# EAGLE design bootloader_burner (EAGLE 9.6.2)
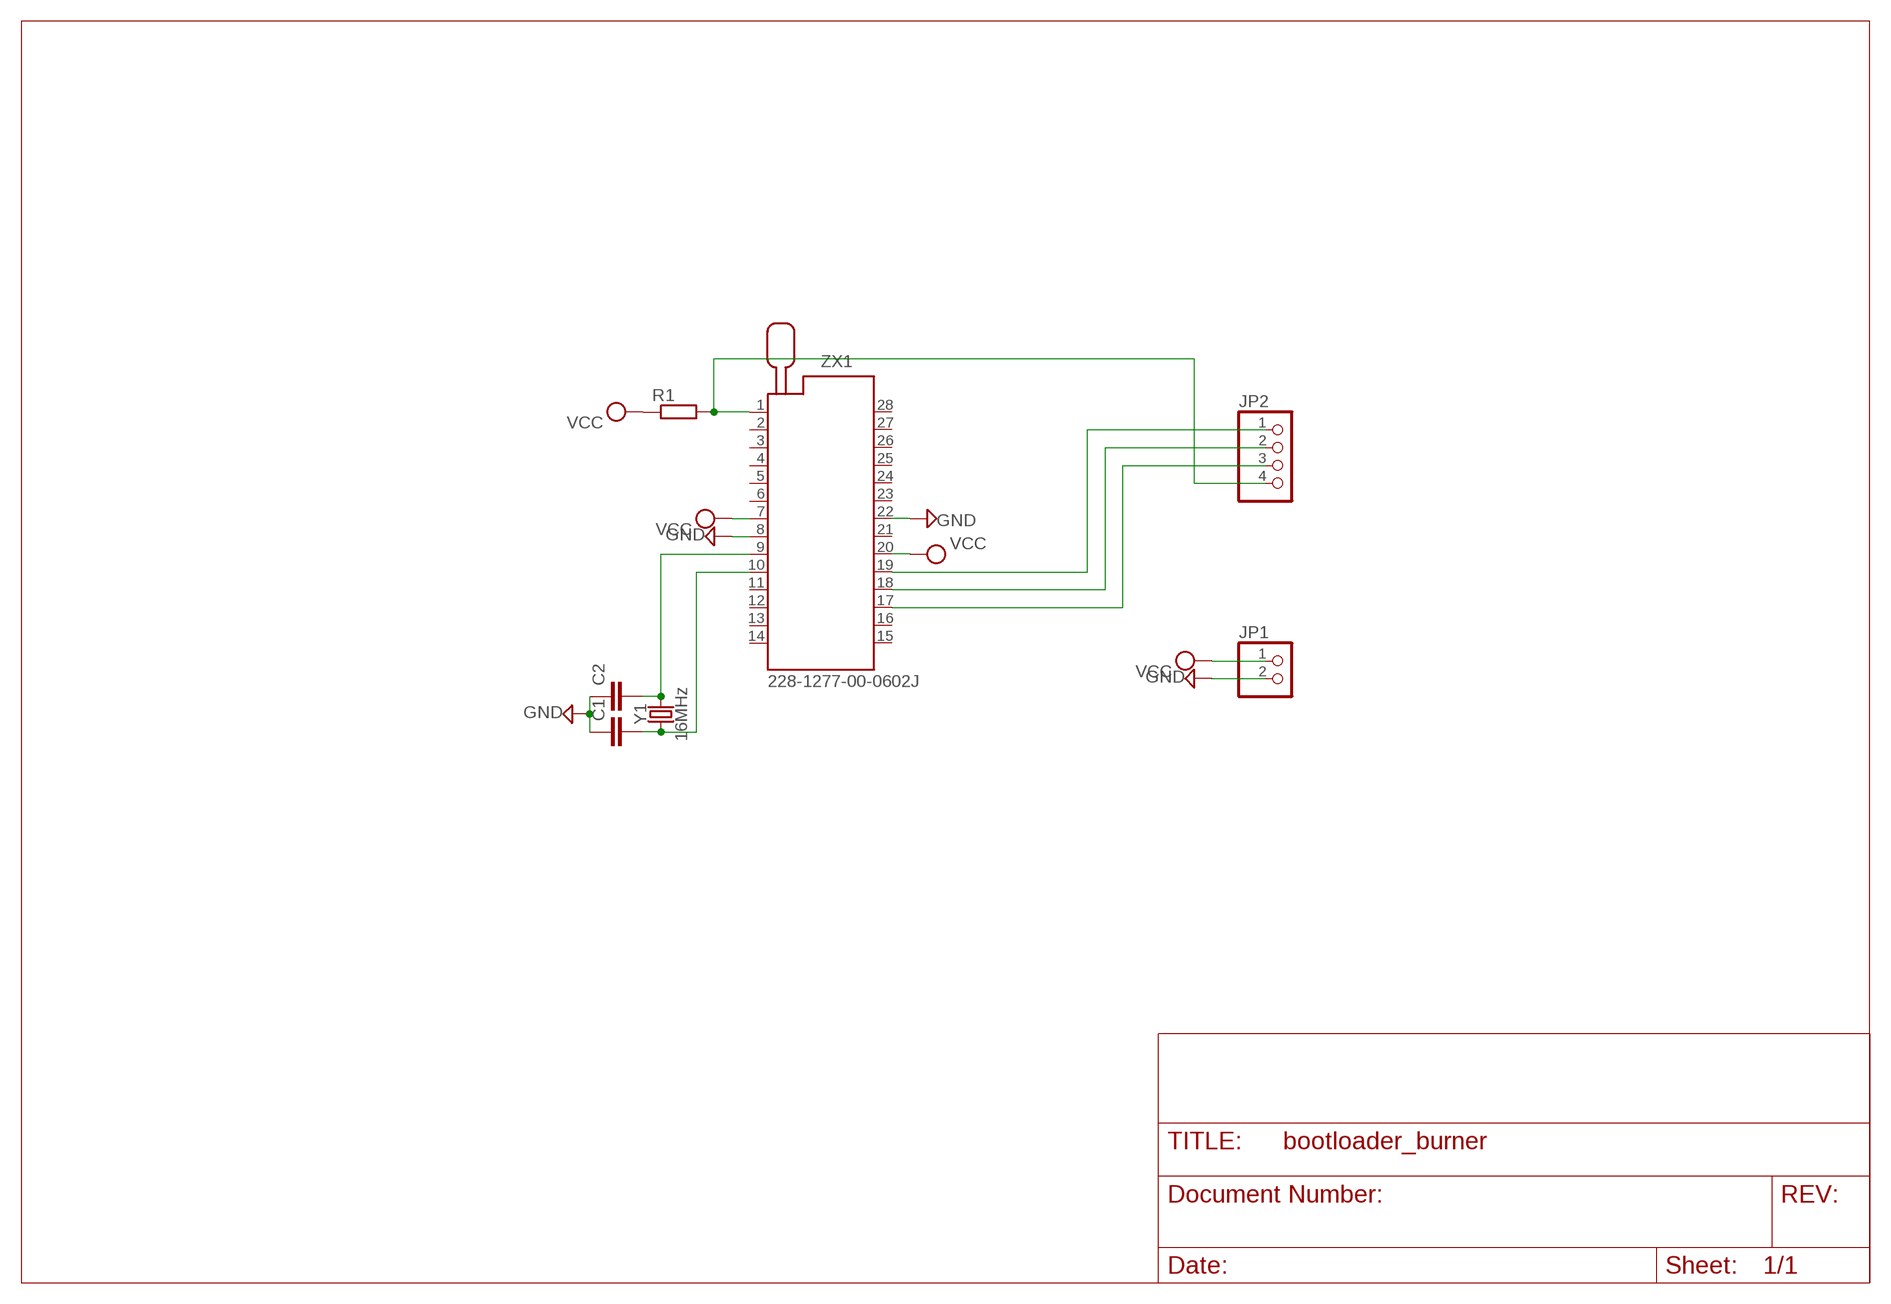
[diagram p0: schematic, sheet 1]

## Parts
C1  C-EU025-025X050  [C025-025X050]
C2  C-EU025-025X050  [C025-025X050]
JP1  PINHD-1X2  [1X02]
JP2  PINHD-1X4  [1X04]
R1  R-EU_0207/10  [0207/10]
Y1  16MHz  CRYSTAL-16MHZPTH-HC49US  [HC49US]
ZX1  228-1277-00-0602J  [228-1277-00-0602J]

## Nets
GND: C1.1 C2.1 JP1.2 ZX1.8 ZX1.22
N$4: C2.2 Y1.2 ZX1.9
N$5: C1.2 Y1.1 ZX1.10
PIN_10_ARDUINO: JP2.4 R1.2 ZX1.1
PIN_11_ARDUINO: JP2.3 ZX1.17
PIN_12_ARDUINO: JP2.2 ZX1.18
PIN_13_ARDUINO: JP2.1 ZX1.19
VCC: JP1.1 R1.1 ZX1.7 ZX1.20
Unconnected: ZX1.2 ZX1.3 ZX1.4 ZX1.5 ZX1.6 ZX1.11 ZX1.12 ZX1.13 ZX1.14 ZX1.15 ZX1.16 ZX1.21 ZX1.23 ZX1.24 ZX1.25 ZX1.26 ZX1.27 ZX1.28

## Library data of the parts
C1 C2 = rcl_capacitor:C-EU: CAPACITOR, European symbol; SPICEPREFIX: C
JP1 = pinhead:PINHD-1X2: PIN HEADER
JP2 = pinhead:PINHD-1X4: PIN HEADER
R1 = rcl:R-EU_: RESISTOR, European symbol; SPICEPREFIX: R
Y1 = SparkFun-Clocks:CRYSTAL-16MHZ: 16MHz Crystal Digikey Example <http://www.digikey.com/product-search/en?keywords=535-9122-1-ND> Frequency: 16MHz Frequency Stability: ±50ppm Frequency Tolerance: ±20ppm Load Capacitance: 18pF SparkFun Products: Pro Micro -5V/16MHz <https://www.sparkfun.com/products/12640> SparkFun Serial Enabled LCD Kit <https://www.sparkfun.com/products/10097>; PROD_ID: XTAL-08181; SF_ID: COM-00536
ZX1 = con-3m:228-?00-0602J: Zero Insertion Force Socked Source: http://www.3M.com/ehpd; MF: 3M; MPN: 228-1277-00-0602J; OC_FARNELL: 9897356; OC_NEWARK: 85K7825

## Net classes
0 default: clearance 0.205 mm

## Board
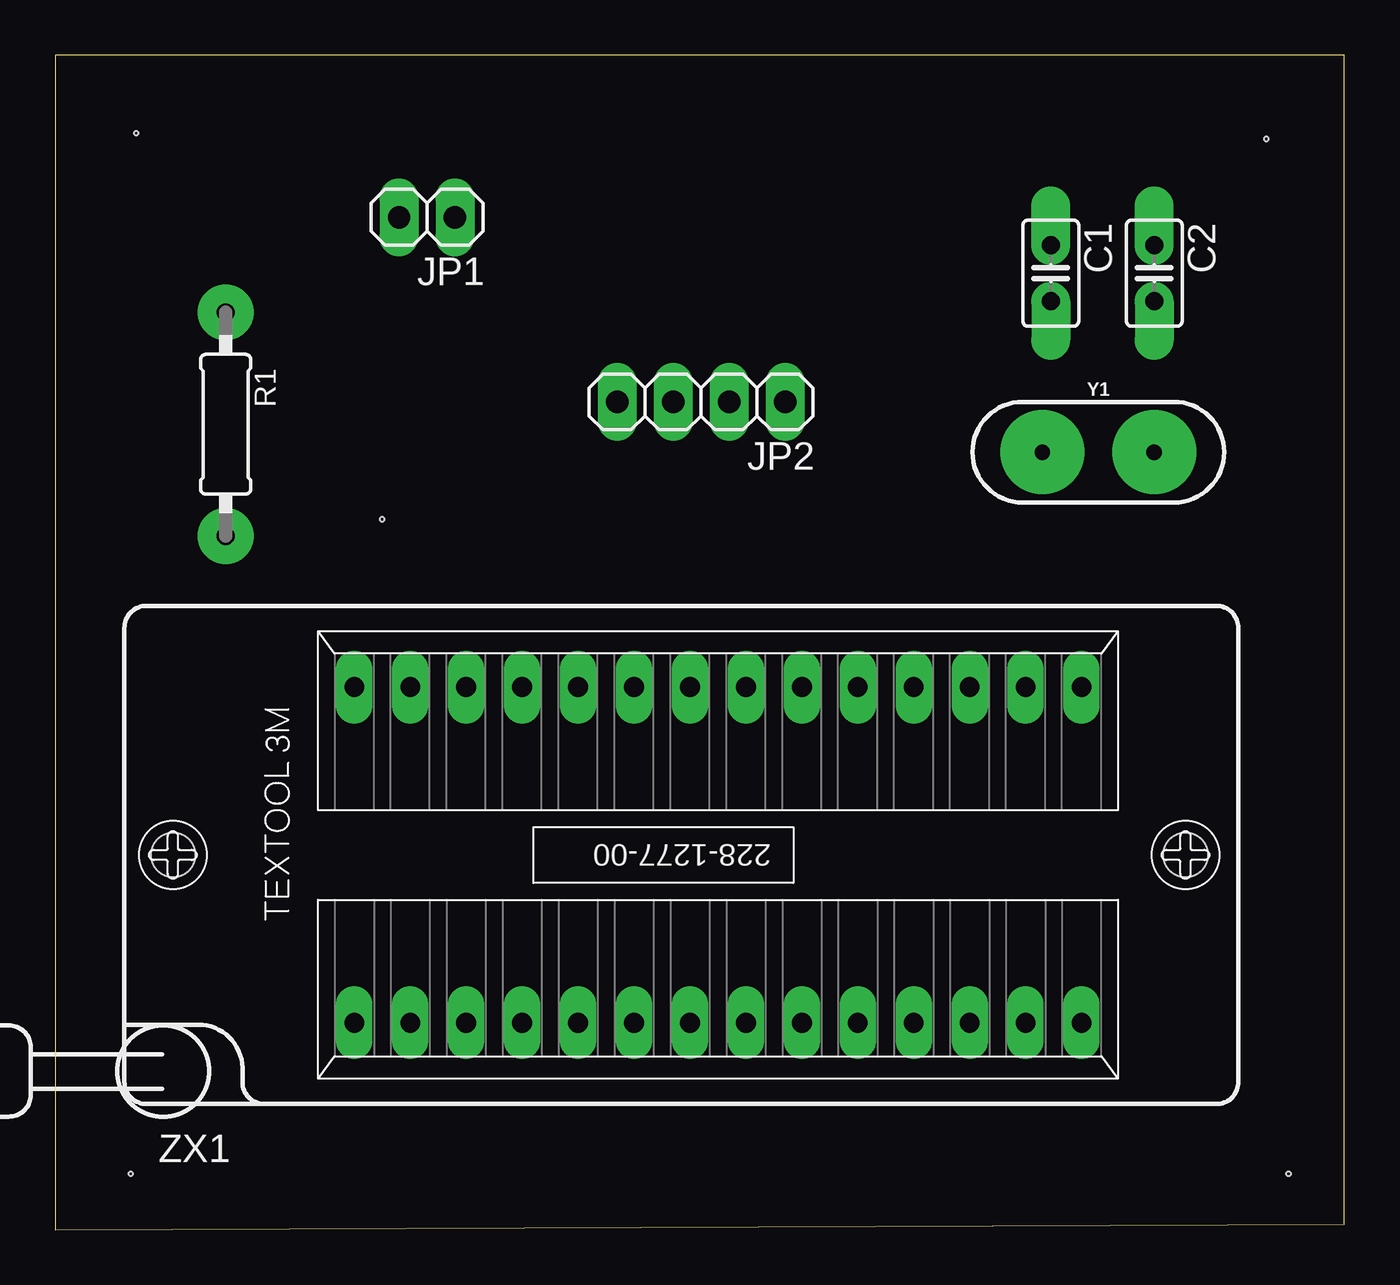
[diagram p1: board, top side]
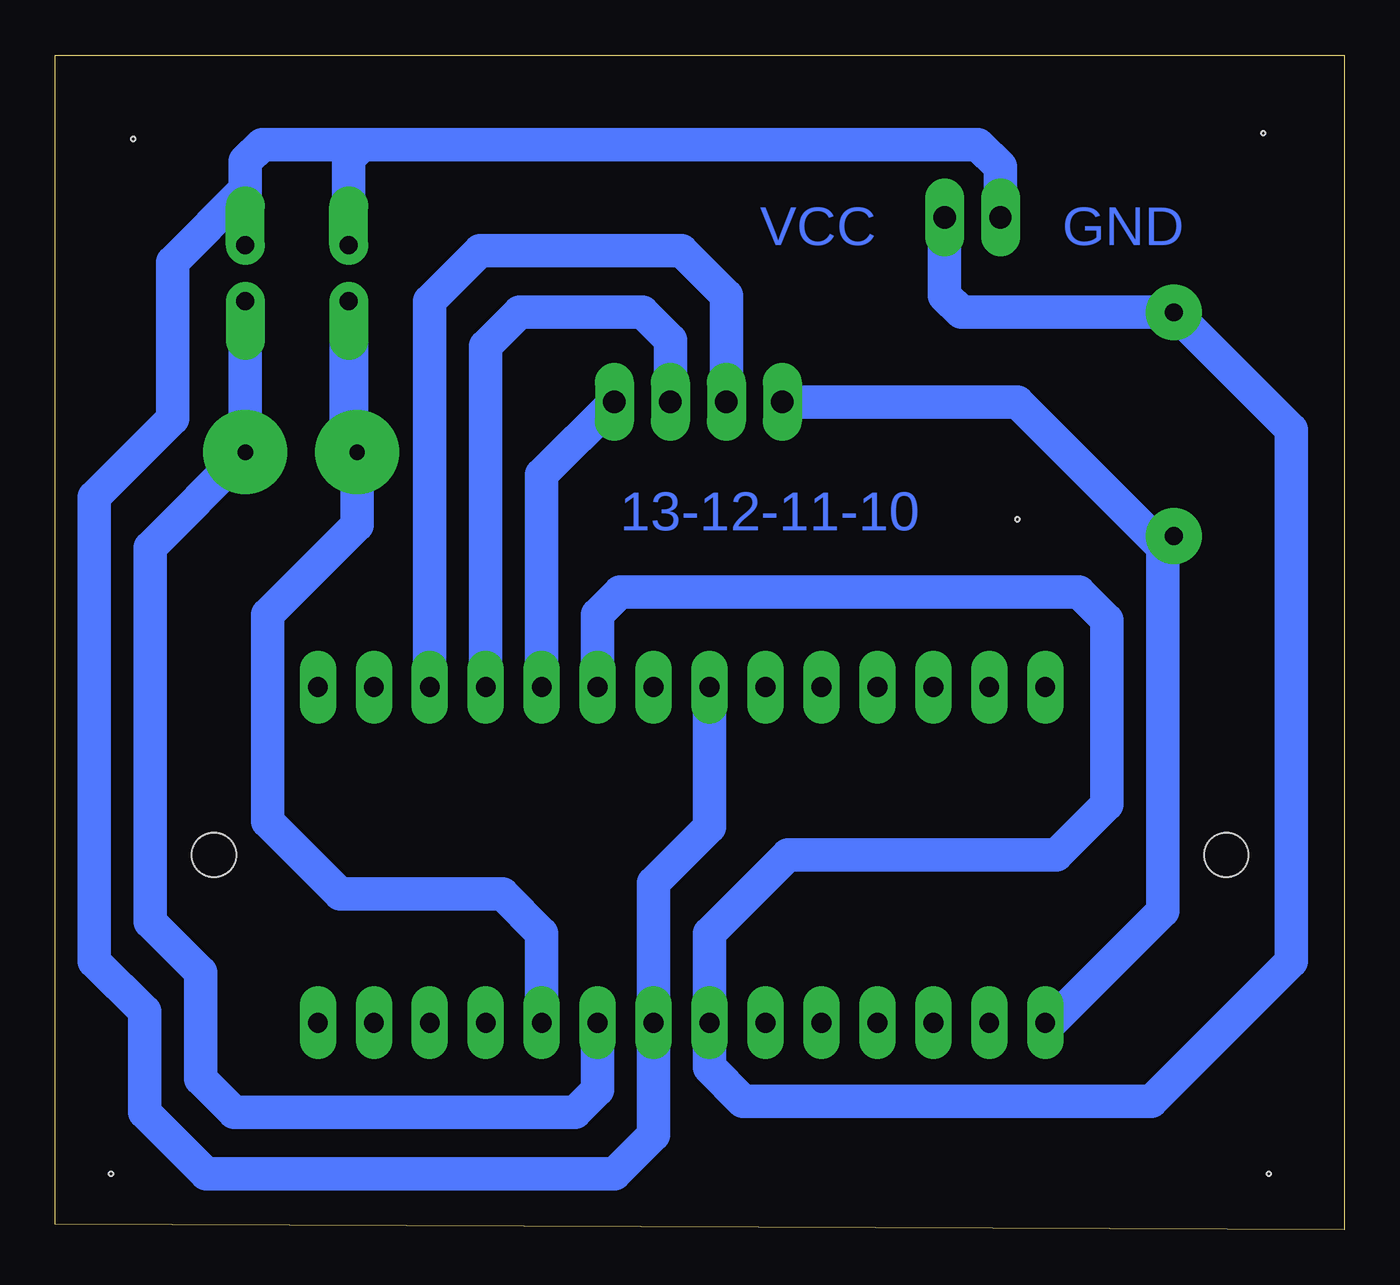
[diagram p2: board, bottom side, seen from below]

Size 58.55 x 53.34 mm. Coordinates in mm from the lower left corner, seen from the top.
Outline: 0,53.34 0,0 58.55,0.25 58.55,53.34 0,53.34
Copper layers (1*16): Top 0.035mm / dielectric 1.5mm / Bottom 0.035mm
Design rules "default *": minimum track width 6mil, minimum drill 0.35mm, track to track 6mil, track to pad 6mil, pad to pad 6mil, via to via 6mil, smd to smd 6mil, copper to edge 40mil, drill to drill 6mil, minimum pad ring 15mil, minimum via ring 8mil, stop-mask expansion 4mil, vias tented up to drill 0mil, thermal gap 10mil
Holes 0.18 mm at 3.68,49.78 54.99,49.53 3.43,2.54 56.01,2.54 14.86,32.26

### Footprints (pad centres in the part's own frame; a part is rotated, then mirrored left to right if it is on the bottom)
C025-025X050 = drill 0.813 pad 1.778 offset: 1 -1.27,0; 2 1.27,0
1X02 = drill 1.016 long: 1 -1.27,0; 2 1.27,0
1X04 = drill 1.016 long: 1 -3.81,0; 2 -1.27,0; 3 1.27,0; 4 3.81,0
0207/10 = drill 0.813 pad 2.54: 1 -5.08,0; 2 5.08,0
HC49US = drill 0.7 pad 3.81: 1 -2.54,0; 2 2.54,0
228-1277-00-0602J = drill 0.9 long: 1 -16.51,-7.62; 2 -13.97,-7.62; 3 -11.43,-7.62; 4 -8.89,-7.62; 5 -6.35,-7.62; 6 -3.81,-7.62; 7 -1.27,-7.62; 8 1.27,-7.62; 9 3.81,-7.62; 10 6.35,-7.62; 11 8.89,-7.62; 12 11.43,-7.62; 13 13.97,-7.62; 14 16.51,-7.62; 15 16.51,7.62; 16 13.97,7.62; 17 11.43,7.62; 18 8.89,7.62; 19 6.35,7.62; 20 3.81,7.62; 21 1.27,7.62; 22 -1.27,7.62; 23 -3.81,7.62; 24 -6.35,7.62; 25 -8.89,7.62; 26 -11.43,7.62; 27 -13.97,7.62; 28 -16.51,7.62 | hole 2: 21.24,0; -24.74,0

### Placement (x,y rotation side)
C1  45.21,43.43 270 top
C2  49.91,43.43 270 top
JP1  16.89,45.97 180 top
JP2  29.34,37.59 180 top
R1  7.75,36.58 270 top
Y1  47.37,35.31 0 top
ZX1  30.1,17.02 0 top

### Tracks (layer width: path | path; a pad name or v marks a point on that pad's centre or on a via)
GND
  Bottom 1.524: ZX1.22 28.83,18.29 31.37,15.75 ZX1.8 31.37,4.32 33.15,2.54 51.69,2.54 54.48,5.33 54.48,9.91 56.77,12.19 56.77,33.27 53.21,36.83 53.21,43.94 49.91,47.24 | 44.58,49.28 45.21,48.64 C1.1 45.21,49.15 45.34,49.28 | C2.1 49.91,47.24 | 49.91,47.24 49.91,48.51 49.15,49.28 45.34,49.28 | JP1.2 15.62,48.26 16.64,49.28 45.34,49.28
N$4
  Bottom 1.524: C2.2 Y1.2 54.23,30.99 54.23,13.97 51.94,11.68 51.94,6.86 50.42,5.33 34.92,5.33 33.91,6.35 ZX1.9 33.91,8.38
N$5
  Bottom 1.524: 44.83,35.05 Y1.1 44.83,32 48.89,27.94 48.89,18.54 45.59,15.24 38.23,15.24 36.45,13.46 ZX1.10
  Bottom 1.778: C1.2 45.21,35.69 Y1.1
PIN_10_ARDUINO
  Bottom 1.524: ZX1.1 13.33,9.4 8.26,14.48 8.26,30.99 | R1.2 8.26,30.99 | 8.26,30.99 14.86,37.59 JP2.4
PIN_11_ARDUINO
  Bottom 1.524: ZX1.17 41.53,42.16 39.24,44.45 30.1,44.45 28.07,42.42 JP2.3
PIN_12_ARDUINO
  Bottom 1.524: ZX1.18 38.99,40.13 37.46,41.66 31.88,41.66 30.61,40.39 JP2.2
PIN_13_ARDUINO
  Bottom 1.524: JP2.1 36.45,34.29 ZX1.19
VCC
  Bottom 1.524: ZX1.20 33.91,27.94 32.89,28.96 12.06,28.96 10.79,27.69 10.79,19.3 13.08,17.02 25.27,17.02 28.83,13.46 ZX1.7 28.83,7.37 27.3,5.84 8.76,5.84 2.41,12.19 2.41,36.32 R1.1 17.4,41.66 18.16,42.42 JP1.1

### Text on the board
Bottom: GND | VCC | 13-12-11-10